# EAGLE schematic work_table_light (EAGLE 9.4.2)
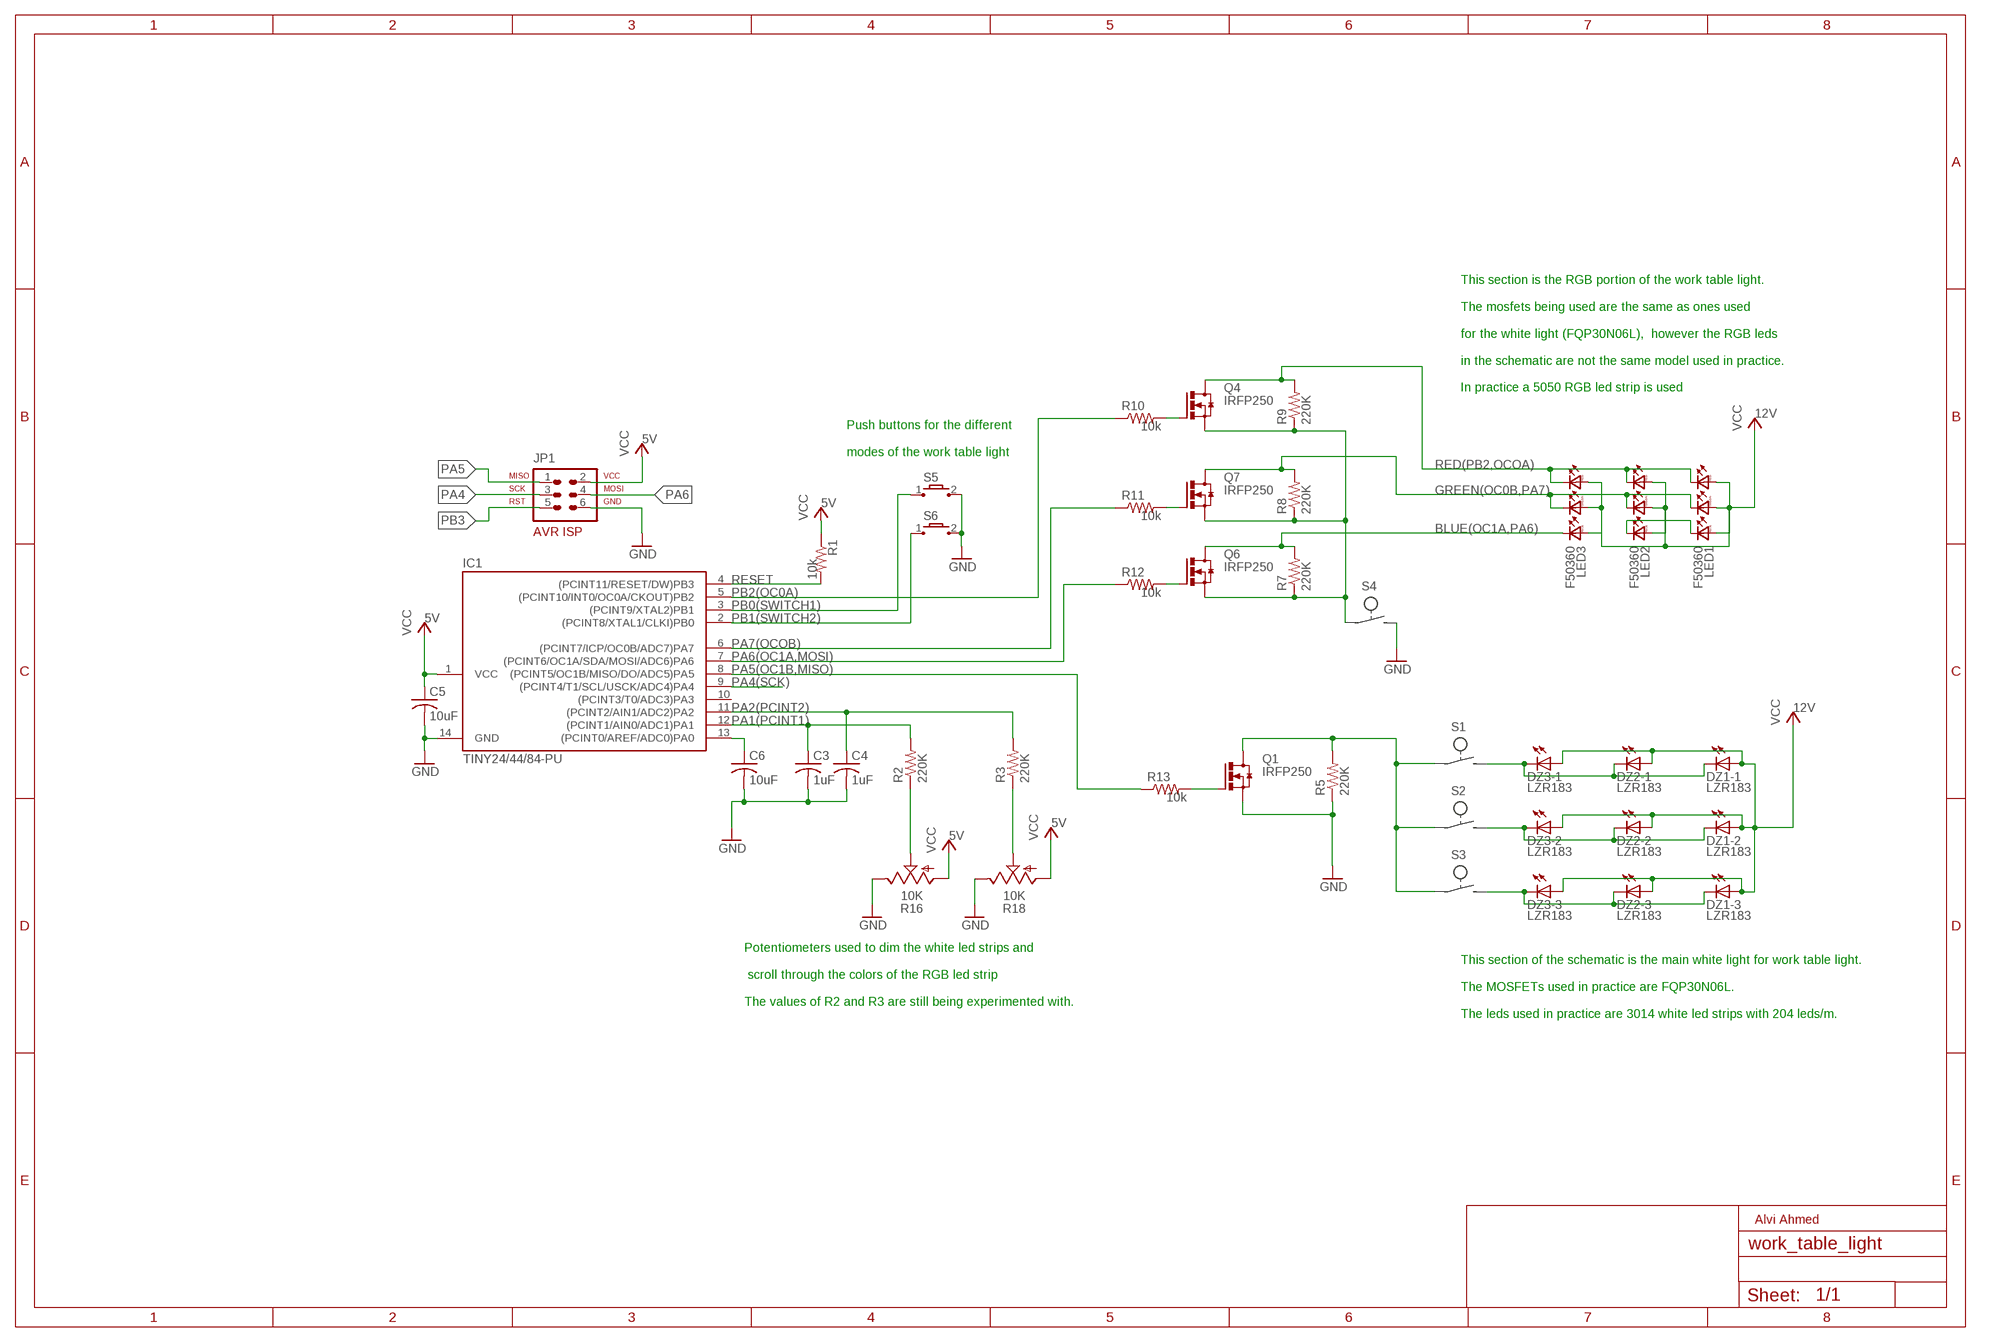
[diagram p0: schematic, sheet 1]

## Parts
C3  1uF  C-US025-024X044  [C025-024X044]
C4  1uF  C-US025-024X044  [C025-024X044]
C5  10uF  C-US025-024X044  [C025-024X044]
C6  10uF  C-US025-024X044  [C025-024X044]
DZ1  LZR183  [LZR183]
DZ2  LZR183  [LZR183]
DZ3  LZR183  [LZR183]
IC1  TINY24/44/84-PU  [DIL14]
JP1  AVR-ISP-6VERT  [AVR-ISP-6]
LED1  F50360  [F50360]
LED2  F50360  [F50360]
LED3  F50360  [F50360]
Q1  IRFP250  [TO-247AD-V]
Q4  IRFP250  [TO-247AD-V]
Q6  IRFP250  [TO-247AD-V]
Q7  IRFP250  [TO-247AD-V]
R1  R-US_0204/5  [0204/5]
R2  220K  R-US_0207/10  [0207/10]
R3  220K  R-US_0207/10  [0207/10]
R5  220K  R-US_0207/10  [0207/10]
R7  220K  R-US_0207/10  [0207/10]
R8  220K  R-US_0207/10  [0207/10]
R9  220K  R-US_0207/10  [0207/10]
R10  R-US_0204/5  [0204/5]
R11  R-US_0204/5  [0204/5]
R12  R-US_0204/5  [0204/5]
R13  R-US_0204/5  [0204/5]
R16  10K  TRIM_US-CIP20C-6MM  [CIP20C-6MM]
R18  10K  TRIM_US-CIP20C-6MM  [CIP20C-6MM]
S5  TL3302-J  [TL3303_J]
S6  TL3302-J  [TL3303_J]
U$1  FRAME_AUTH  [FRAME_AUTH]

## Nets
BLUE(OC1A,PA6): LED3.BC Q6.D R7.2
GND: C3.2 C4.2 C5.2 C6.2 IC1.14(GND) JP1.6 Q1.S R5.1 R16.E R18.E S5.2 S6.2
GREEN(OC0B,PA7): LED1.GC LED2.GC LED3.GC Q7.D R8.2
N$1: Q4.G R10.2
N$2: DZ1.K3(-3:C) DZ2.K3(-3:C) DZ3.K3(-3:C)
N$3: C6.1 IC1.13((PCINT0/AREF/ADC0)PA0)
N$6: Q7.G R11.2
N$7: Q1.G R13.2
N$8: Q6.G R12.2
N$10: Q4.S Q6.S Q7.S R7.1 R8.1 R9.1
N$11: Q1.D R5.2
N$12: DZ1.K1(-1:C) DZ2.K1(-1:C) DZ3.K1(-1:C)
N$13: DZ1.K2(-2:C) DZ2.K2(-2:C) DZ3.K2(-2:C)
N$21: LED1.BC LED2.BC
N$22: R3.1 R18.S
N$23: R2.1 R16.S
PA1(PCINT1): C3.1 IC1.12((PCINT1/AIN0/ADC1)PA1) R2.2
PA2(PCINT2): C4.1 IC1.11((PCINT2/AIN1/ADC2)PA2) R3.2
PA4: JP1.3
PA4(SCK): IC1.9((PCINT4/T1/SCL/USCK/ADC4)PA4)
PA5: JP1.1
PA5(OC1B,MISO): IC1.8((PCINT5/OC1B/MISO/DO/ADC5)PA5) R13.1
PA6: JP1.4
PA6(OC1A,MOSI): IC1.7((PCINT6/OC1A/SDA/MOSI/ADC6)PA6) R12.1
PA7(OCOB): IC1.6((PCINT7/ICP/OC0B/ADC7)PA7) R11.1
PB0(SWITCH1): IC1.3((PCINT9/XTAL2)PB1) S5.1
PB1(SWITCH2): IC1.2((PCINT8/XTAL1/CLKI)PB0) S6.1
PB2(OC0A): IC1.5((PCINT10/INT0/OC0A/CKOUT)PB2) R10.1
PB3: JP1.5
RED(PB2,OCOA): LED1.RC LED2.RC LED3.RC Q4.D R9.2
RESET: IC1.4((PCINT11/RESET/DW)PB3) R1.2
VCC: C5.1 DZ1.A1(-1:A) DZ1.A2(-2:A) DZ1.A3(-3:A) DZ2.A1(-1:A) DZ2.A2(-2:A) DZ2.A3(-3:A) DZ3.A1(-1:A) DZ3.A2(-2:A) DZ3.A3(-3:A) IC1.1(VCC) JP1.2 LED1.BA LED1.GA LED1.RA LED2.BA LED2.GA LED2.RA LED3.BA LED3.GA LED3.RA R1.1 R16.A R18.A
Unconnected: IC1.10((PCINT3/T0/ADC3)PA3)

## Notes on the sheet
- This section is the RGB portion of the work table light.  
  
  The mosfets being used are the same as ones used 
  
  for the white light (FQP30N06L),  however the RGB leds 
  
  in the schematic are not the same model used in practice.
  
  In practice a 5050 RGB led strip is used
- Push buttons for the different 
  
  modes of the work table light
- Potentiometers used to dim the white led strips and
  
   scroll through the colors of the RGB led strip
  
  The values of R2 and R3 are still being experimented with.
- This section of the schematic is the main white light for work table light.
  
  The MOSFETs used in practice are FQP30N06L. 
  
  The leds used in practice are 3014 white led strips with 204 leds/m.

## Library data of the parts
C3-C6 = adafruit:C-US: CAPACITOR, American symbol
DZ1-DZ3 = led:LZR183: LED BLOCK 3 LEDs, Siemens
IC1 = avr-7:TINY24/44/84
JP1 = avr-7:AVR-ISP-6: AVR ISP-6 Serial Programming Header
LED1-LED3 = led:F50360: Full color Z-Power LED RGB P5-II Series Source: http://www.seoulsemicon.co.kr .. F50360.pdf
Q1 Q4 Q6 Q7 = transistor-power:IRFP25*: 33A/27A, 200V/150V, 0.085/0.012 Ohm, N-Channel Power MOSFET Source: Fairchild Semiconductor Corporation
R1 R10-R13 = rcl:R-US_: RESISTOR, American symbol; SPICEPREFIX: 10k
R2 R3 R5 R7-R9 = resistor:R-US_: RESISTOR, American symbol
R16 R18 = pot:TRIM_US-: POTENTIOMETER
S5 S6 = eswitch-tact:TL3302: E-Switch TL3302 Series Tactile Switch Surface mount button commonly used for reset or general input. 3.5 x 6mm packaged design. -G: Gull wing termination. Parts TL-3302-x-xxxx-x-G -J: J-Lead termination. Parts TL-3302-x-xxxx-x-J Source: http://www.e-switch.com/Portals/0/Series_Pdf/TL3302.pdf Supplier: DigiKey: http://be.digikey.com/scripts/dksearch/dksus.dll?vendor=0&keywords=TL3302
U$1 = frame_with_author:FRAME_AUTH